# Altium schematic sheet 2  - Battery Sensing.SchDoc
size A4
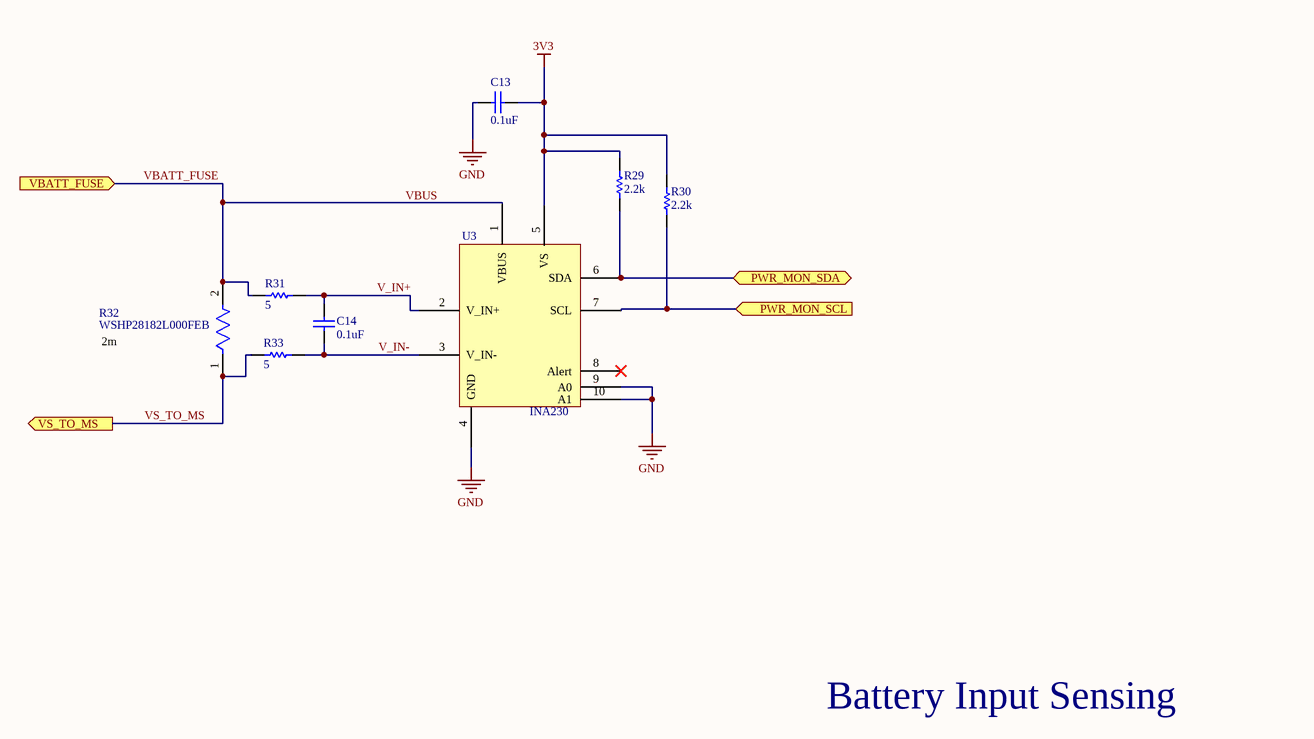
[diagram p0: 2  - Battery Sensing.SchDoc]

## Parts
C13  value 0.1uF  [0603R-generic]  (hidden comment: Cap)
C14  value 0.1uF  [0603R-generic]  (hidden comment: Cap)
R29  2.2k  [RESC0603(1608)_L]
R30  2.2k  [RESC0603(1608)_L]
R31  5  [RESC0603(1608)_L]
R32  WSHP28182L000FEB  [FP-WSHP2818-MFG]
R33  5  [RESC0603(1608)_L]
U3  INA230  [SOP50P490X110-10N]

## Ports
PWR_MON_SCL (in), PWR_MON_SDA (bidir), VBATT_FUSE (in), VS_TO_MS (out)

## Nets
3V3: C13.1 R29.2 R30.2 U3.5(VS)
GND: C13.2 U3.4(GND) U3.9(A0) U3.10(A1)
PWR_MON_SCL: R30.1 U3.7(SCL) ; port PWR_MON_SCL
PWR_MON_SDA: R29.1 U3.6(SDA) ; port PWR_MON_SDA
V_IN+: C14.2 R31.1 U3.2(V_IN+)
V_IN-: C14.1 R33.1 U3.3(V_IN-)
VBATT_FUSE: R31.2 R32.2 U3.1(VBUS) ; port VBATT_FUSE
VS_TO_MS: R32.1 R33.2 ; port VS_TO_MS

Not connected (* = marked no-connect by the designer): U3 8(Alert)*

## Notes on the sheet
- 2m
- Battery Input Sensing
- Labels drawn without touching a wire or pin: VBUS

## Library data of the parts
C13 C14 = Cap: Capacitor; Manufacturer: Yageo; Manufacturer Part Number: CC1210ZKY5V8BB106; Capacitance: 10µF; Tolerance: -20%, +80%; Voltage - Rated: 25V; Temperature Coefficient: Y5V (F); Supplier 1: Digi-Key; Supplier Part Number 1: 311-2063-1-ND; RoHS: RoHS Compliant; Category: Capacitors; Stock 1: 1156; Pricing 1: 1=0.47, 10=0.323, 25=0.258, 50=0.2154, 100=0.1829, 250=0.14528, 500=0.12912, 1000=0.11298 (CAD); Packaging: Cut Tape (CT); Part Status: Active; Operating Temperature: -30°C ~ 85°C; Features: -; Ratings: -; Applications: General Purpose; Failure Rate: -; Mounting Type: Surface Mount, MLCC; Package / Case: 1210 (3225 Metric); Size / Dimension: 0.126" L x 0.098" W (3.20mm x 2.50mm); Height - Seated (Max): -; Thickness (Max): 0.083" (2.10mm); Lead Spacing: -; Lead Style: -; ComponentLink1URL: http://www.yageo.com/documents/recent/UPY-GPHC_Y5V_6.3V-to-50V_7.pdf; ComponentLink1Description: http://www.yageo.com/documents/recent/UPY-GPHC_Y5V_6.3V-to-50V_7.pdf; Supplier 2: Digi-Key; Supplier Part Number 2: 1276-1869-1-ND
R29-R31 R33 = CMP-1591-00001-1: 0603 (1608 Metric) Chip Resistor; Case-Metric: 1608; Case-EIA: 0603; PackageReference: RESC0603(1608); Supplier 1: Digi-Key; Supplier Part Number 1: P430BZCT-ND
R32 = CMP-00030-78727543-1: WSHP28182L000FEB Res Metal Strip 2818 0.002 Ohm 1% 10W ±200ppm/C Pad SMD Automotive T/R; Temperature Coefficient: 200ppm/°C; Resistance: 2mΩ; Case/Package: 2818; Packaging: Cut Tape; NexarPartId: 78727543; Composition: Metal Element; Height: 3.43mm; Power Rating: 10W; Min Operating Temperature: -65°C; Schedule B: 8533210045, 8533210045; Max Operating Temperature: 170°C; Tolerance: 1%; RoHS: Non-Compliant